# Altium schematic sheet jtag.SchDoc
size A4
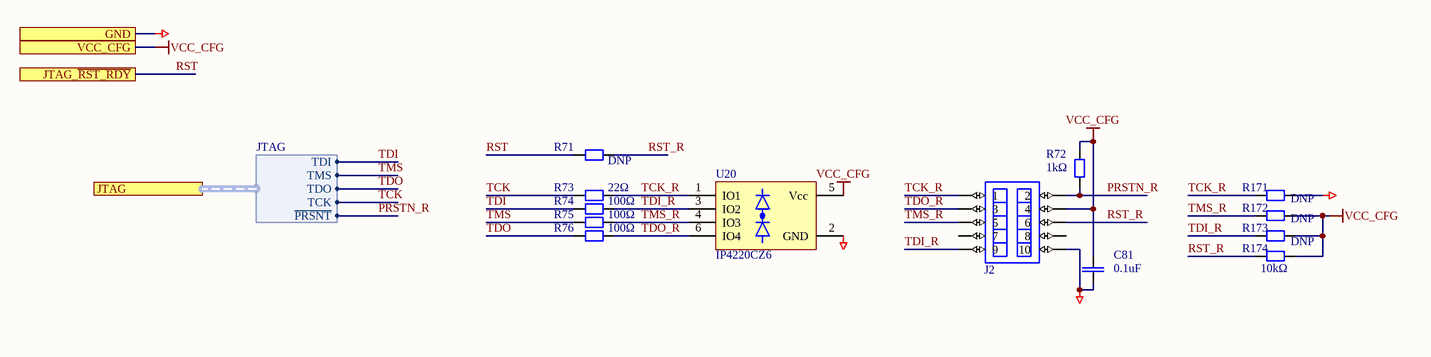
[diagram p0: jtag.SchDoc]

## Parts
C81  0.1uF  [CAPC2012N]
J2  IDC-10MC  [PLD-10]  (value not drawn)
R71  DNP  [RESC1608N]
R72  1kΩ  [RESC2012N]
R73  22Ω  [RESC1608N]
R74  100Ω  [RESC1608N]
R75  100Ω  [RESC1608N]
R76  100Ω  [RESC1608N]
R171  DNP  [RESC2012N]
R172  DNP  [RESC2012N]
R173  DNP  [RESC2012N]
R174  10kΩ  [RESC2012N]
U20  IP4220CZ6  [SOT95P285X110-6N]

## Ports
GND, JTAG (harness JTAG), JTAG_~{RST_RDY}, VCC_CFG

## Harnesses
JTAG: TDI, TMS, TDO, TCK, ~{PRSNT}

## Nets
GND: C81.1 J2.10 R171.2 U20.2(GND) ; port GND
VCC_CFG: C81.2 J2.4 R72.2 R172.2 R173.2 R174.2 U20.5(Vcc) ; port VCC_CFG
PRSTN_R: J2.2 R72.1 ; port JTAG.~{PRSNT}
RST: R71.1 ; port JTAG_~{RST_RDY}
RST_R: J2.6 R71.2 R174.1
TCK: R73.1 ; port JTAG.TCK
TCK_R: J2.1 R73.2 R171.1 U20.1(IO1)
TDI: R74.1 ; port JTAG.TDI
TDI_R: J2.9 R74.2 R173.1 U20.3(IO2)
TDO: R76.1 ; port JTAG.TDO
TDO_R: J2.3 R76.2 U20.6(IO4)
TMS: R75.1 ; port JTAG.TMS
TMS_R: J2.5 R75.2 R172.1 U20.4(IO3)

Not connected (* = marked no-connect by the designer): J2 7 8

## Library data of the parts
C81 = CAPC: Generic ceramic SMD capacitor; Pkg: 0805; Maintainer: Evgeniy Kotov; SMD Solders: 2; THD Solders: 0; PartField: 0.1uF; Last Change Data: 06.03.2017; Release Date: 06.03.2017; Value: 0.1uF
J2 = IDC-10MS: Connector, 5x2, Male, 2.54mm Pitch, Strait contacts, with Body; SMD Solders: 0; THD Solders: 10; Maintainer: Evgeniy Kotov; Pkg: IDC-10; PartField: IDC-10MC; Last Change Data: 28.03.2017; Release Date: 28.03.2017; Value: IDC-10MC; ComponentLink1Description: Datasheet
R71 = RESC: Resistor, Generic, SMD; PartField: 100Ω; Pkg: 0603; Maintainer: Evgeniy Kotov; SMD Solders: 2; THD Solders: 0; Release Date: 06.03.2017; Last Change Data: 09.03.2017; Value: DNP
R72 R174 = RESC: Resistor, Generic, SMD; Pkg: 0805; Maintainer: Evgeniy Kotov; SMD Solders: 2; THD Solders: 0; Release Date: 06.03.2017; Last Change Data: 09.03.2017
  R72: PartField: 1kΩ; Value: 1kΩ
  R174: PartField: 10kΩ; Value: 10kΩ
R73-R76 = RESC: Resistor, Generic, SMD; Pkg: 0603; Maintainer: Evgeniy Kotov; SMD Solders: 2; THD Solders: 0; Release Date: 06.03.2017; Last Change Data: 09.03.2017
  R73: PartField: 22Ω; Value: 22Ω
  R74-R76: PartField: 100Ω; Value: 100Ω
R171 = RESC: Resistor, Generic, SMD; PartField: 1kΩ; Pkg: 0805; Maintainer: Evgeniy Kotov; SMD Solders: 2; THD Solders: 0; Release Date: 06.03.2017; Last Change Data: 09.03.2017; Value: DNP
R172 R173 = RESC: Resistor, Generic, SMD; PartField: 10kΩ; Pkg: 0805; Maintainer: Evgeniy Kotov; SMD Solders: 2; THD Solders: 0; Release Date: 06.03.2017; Last Change Data: 09.03.2017; Value: DNP
U20 = IP4220CZ6: Transimpedance Amplifier; Selectable-Feedback Resistance; Pkg: SOT457; SMD Solders: 6; THD Solders: 0; Maintainer: Evgeniy Kotov; Vendor: NXP; PartField: IP4220CZ6; ComponentLink1URL: http://assets.nexperia.com/documents/data-sheet/IP4220CZ6.pdf; ComponentLink1Description: Datasheet; Last Change Date: 28.03.2017; Release Date: 28.03.2017; Value: IP4220CZ6